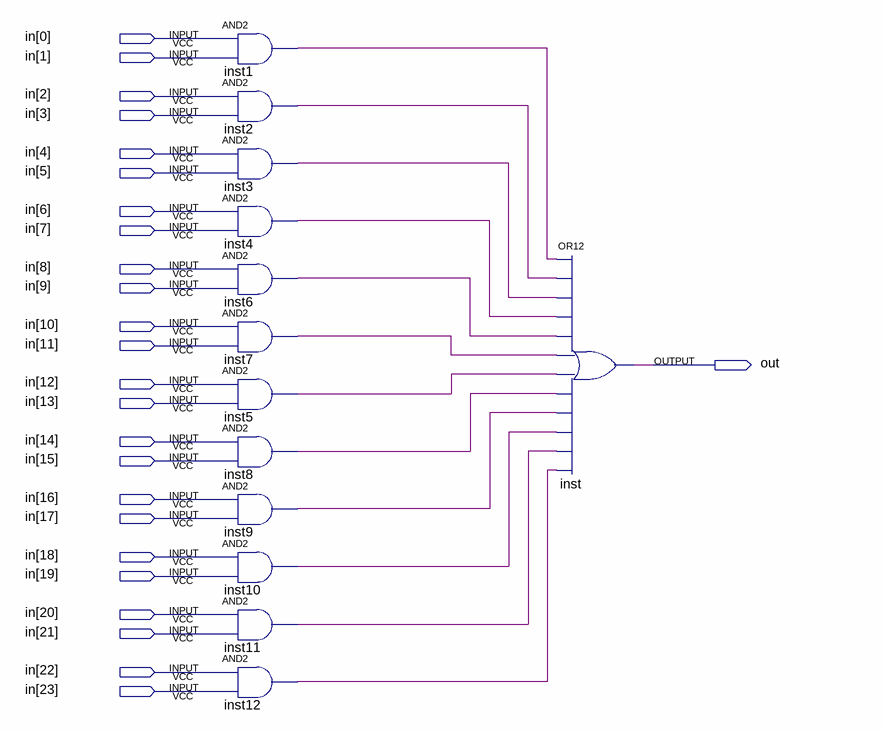
[diagram p0: schematic sheet]
// Quartus schematic and24or.bdf as structural Verilog: 13 symbols, 25 pins
module and24or (
  input  [23:0] in,
  output out
);

  wire inst1_out, inst2_out, inst3_out, inst4_out, inst5_out, inst6_out, inst7_out, inst8_out, inst9_out,
       inst10_out, inst11_out, inst12_out;

  and inst1 (inst1_out, in[0], in[1]);
  and inst2 (inst2_out, in[2], in[3]);
  and inst3 (inst3_out, in[4], in[5]);
  and inst4 (inst4_out, in[6], in[7]);
  and inst6 (inst6_out, in[8], in[9]);
  and inst7 (inst7_out, in[10], in[11]);
  and inst5 (inst5_out, in[12], in[13]);
  and inst8 (inst8_out, in[14], in[15]);
  and inst9 (inst9_out, in[16], in[17]);
  and inst10 (inst10_out, in[18], in[19]);
  and inst11 (inst11_out, in[20], in[21]);
  and inst12 (inst12_out, in[22], in[23]);
  or inst (out, inst1_out, inst2_out, inst3_out, inst4_out, inst6_out, inst7_out, inst5_out, inst8_out, inst9_out, inst10_out, inst11_out, inst12_out);
endmodule
